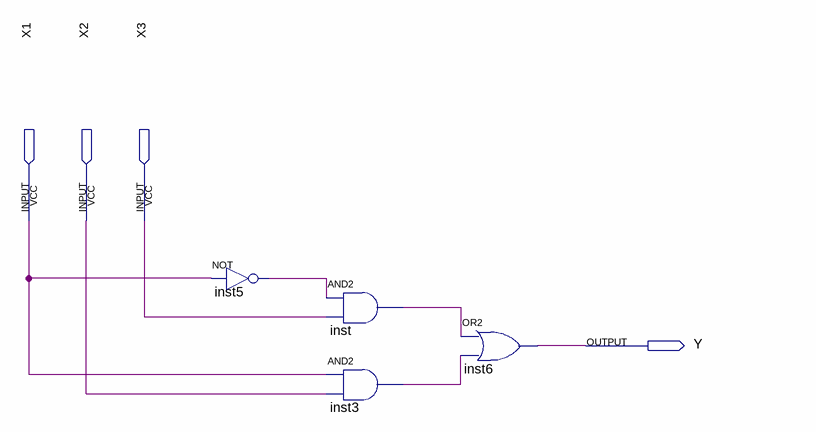
[diagram p0: schematic sheet]
// Quartus schematic Lab2-1.bdf as structural Verilog: 4 symbols, 4 pins
module \Lab2-1  (
  input  X1,
  input  X2,
  input  X3,
  output Y
);

  wire inst3_out, inst5_out, inst_out;

  not inst5 (inst5_out, X1);
  and inst (inst_out, inst5_out, X3);
  and inst3 (inst3_out, X1, X2);
  or inst6 (Y, inst_out, inst3_out);
endmodule
